# EAGLE design lcTempLogger (EAGLE 7.5.0)
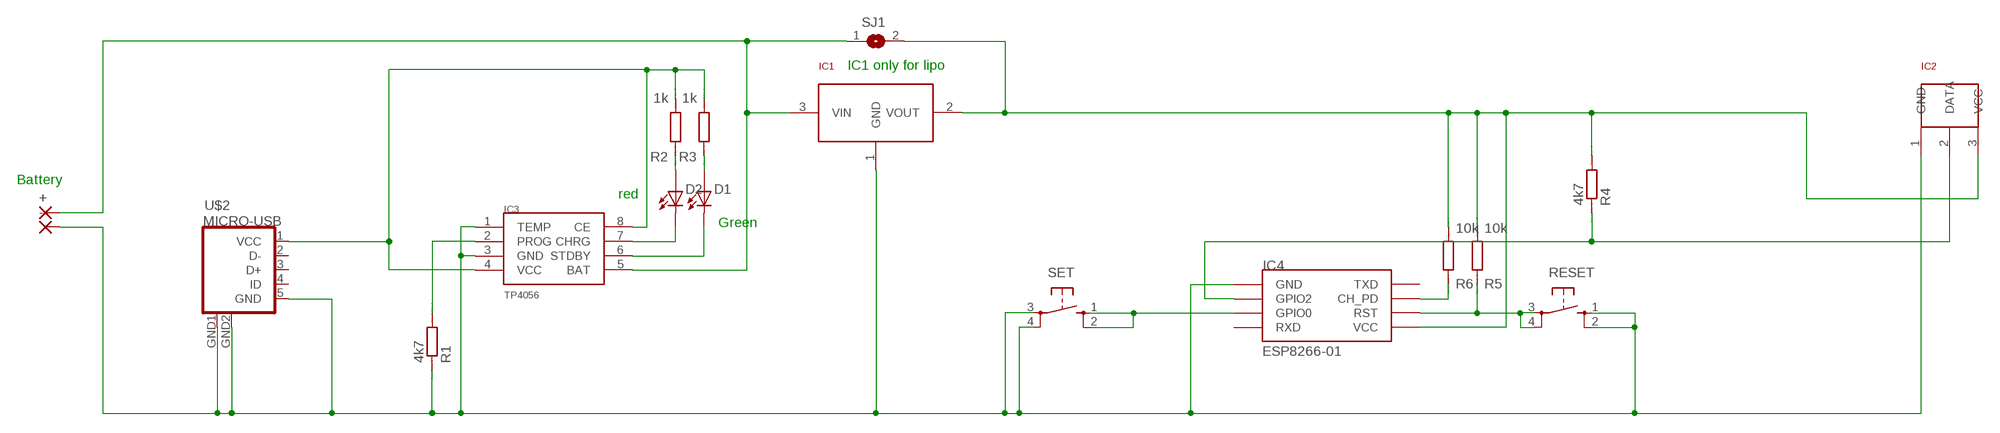
[diagram p0: schematic, sheet 1]

## Parts
+  1,6/0,8  [1,6/0,8]
-  1,6/0,8  [1,6/0,8]
D1  LED-0805  [CHIPLED_0805]
D2  LED-0805  [CHIPLED_0805]
IC1  MCP1700  MCP1700SOT-32  [SOT-23]
IC2  DS18B20TO-92  [TO-92]
IC3  TP4056  [SOP-8]
IC4  ESP8266-01  [ESP01]
R1  4k7  RR1206  [R1206]
R2  1k  R  [R0805]
R3  1k  R  [R0805]
R4  4k7  RR1206  [R1206]
R5  10k  RR1206  [R1206]
R6  10k  RR1206  [R1206]
RESET  10-XX  [B3F-10XX]
SET  10-XX  [B3F-10XX]
SJ1  SJ  [SJ]
U$2  MICRO-USB  [MICRO-USB]

## Nets
3V: IC1.2(VOUT) IC2.3(VCC) IC4.VCC R4.2 R5.2 R6.2 SJ1.2
5V_USB: IC3.4(VCC) IC3.8(CE) R2.2 R3.2 U$2.1(VCC)
GND: -.1(P) IC1.1(GND) IC2.1(GND) IC3.1(TEMP) IC3.3(GND) IC4.GND R1.1 RESET.1 RESET.2 SET.3 SET.4 U$2.5(GND) U$2.GND1(GND) U$2.GND2(GND)
N$2: D2.C(K) IC3.7(CHRG)
N$3: IC2.2(DATA) IC4.GPIO2 R4.1
N$4: +.1(P) IC1.3(VIN) IC3.5(BAT) SJ1.1
N$5: IC4.GPIO0 SET.1 SET.2
N$7: D1.C(K) IC3.6(STDBY)
N$8: IC3.2(PROG) R1.2
N$9: D2.A R2.1
N$10: D1.A R3.1
N$11: IC4.RST R5.1 RESET.3 RESET.4
N$12: IC4.CH_PD R6.1
Unconnected: IC4.RX(RXD) IC4.TX(TXD) U$2.2(D-) U$2.3(D+) U$2.4(ID)

## Notes on the sheet
- IC1 only for lipo
- Battery
- red
- Green

## Library data of the parts
+ - = wirepad:1,6/0,8: THROUGH-HOLE PAD
D1 D2 = Basic:LED: LED
IC1 = templogger:MCP1700: MCP1700 Low Quiescent Current LDO
IC2 = templogger:DS18B20: Programmable Resolution Digital Thermometer This chip provides a onewire thermosensor with approx. 0.5°C accuracy. A programmable over/undertemperure alarm is available. The precision can be set from 9..12 bits. Notes: Vdd must be applied for accurate measurements at low temperatures, as the parasite power circuit otherwise heats the sensor. If parasite power is used, Vdd has to be connected to GND. The DS1822 is a low-cost thermometer chip, the DS18S20 is similar to the DS18B20, but with 9 Bit precision only. Author: Jan Kandziora <jjj@gmx.de>
IC3 = templogger:TP4056
IC4 = templogger:ESP8266-01: ESP8266 Wifi module 01
R1-R6 = eagle-ltspice:R: RESISTOR, European symbol; SPICEMODEL: NONE; SPICEPREFIX: R
RESET SET = Basic:10-XX: OMRON SWITCH
SJ1 = jumper:SJ: SMD solder JUMPER
U$2 = templogger:MICRO-USB: Micro USB B connector

## Board
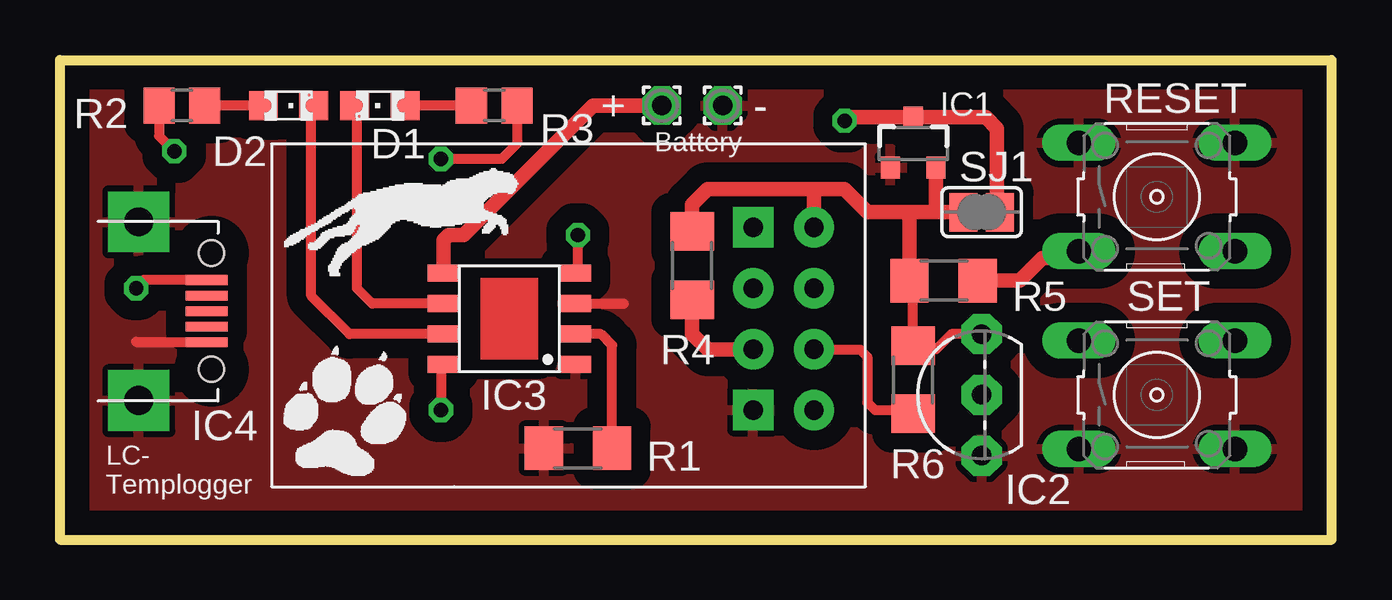
[diagram p1: board, top side]
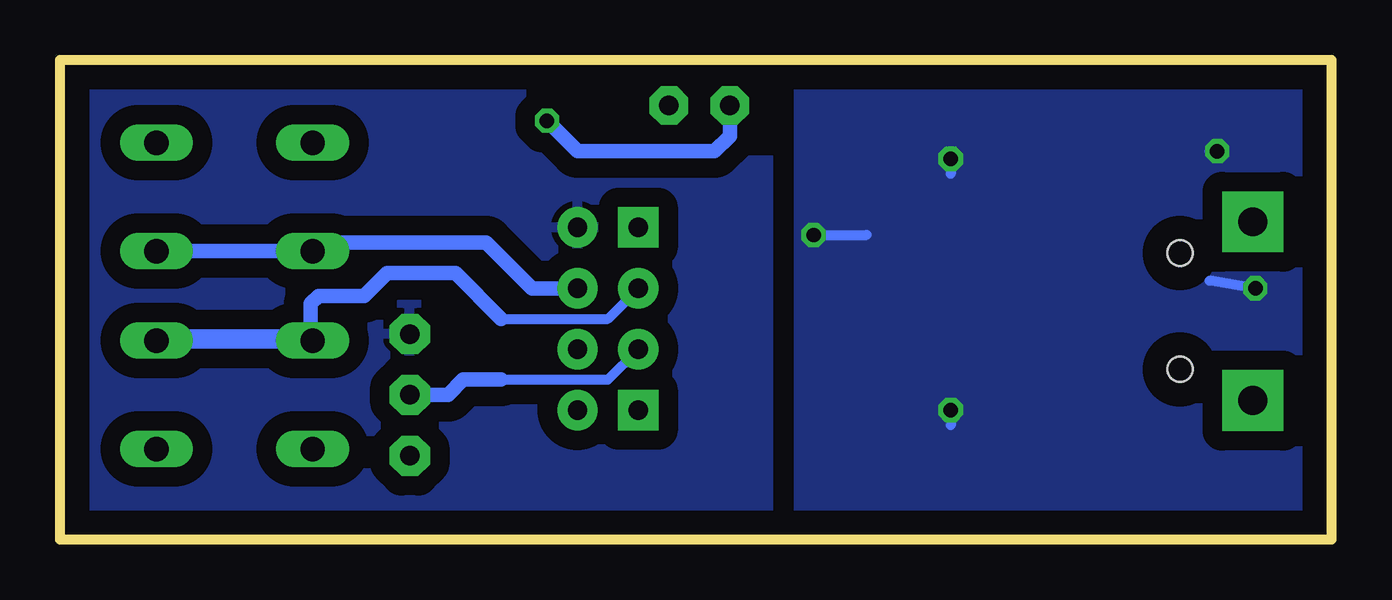
[diagram p2: board, bottom side, seen from below]

Size 53 x 20 mm. Coordinates in mm from the lower left corner, seen from the top.
Outline: 0,0 0,20 53,20 53,0 0,0
Copper layers (1*16): Top 0.035mm / dielectric 1.5mm / Bottom 0.035mm
Design rules "default": minimum track width 10mil, minimum drill 24mil, track to track 8mil, track to pad 8mil, pad to pad 8mil, via to via 8mil, smd to smd 8mil, copper to edge 40mil, drill to drill 8mil, minimum pad ring 10mil, minimum via ring 8mil, stop-mask expansion 4mil, vias tented up to drill 0mil, thermal gap 10mil
bRestrict: area 36.2,7.3 to 37.1,9.5; area 23.5,16.8 to 24.1,18.7

### Footprints (pad centres in the part's own frame; a part is rotated, then mirrored left to right if it is on the bottom)
1,6/0,8 = drill 0.813 pad 1.6 octagon: 1 0,0
CHIPLED_0805 = smd 1.2 x 1.2: A 0,-1.05; C 0,1.05
SOT-23 = smd 0.8 x 0.9: 1 -0.95,-1; 2 0.95,-1; 3 0,1.1
TO-92 = drill 0.813 pad 1.676 octagon: 1 -2.54,0; 2 0,0; 3 2.54,0
SOP-8 = smd 1.3 x 0.7: 1 -2.75,1.905; 2 -2.75,0.635; 3 -2.75,-0.635; 4 -2.75,-1.905; 5 2.75,-1.905; 6 2.75,-0.635; 7 2.75,0.635; 8 2.75,1.905
ESP01 = drill 0.8 pad 1.676: CH_PD -1.27,-7.62; GPIO0 1.27,-5.08; GPIO2 -1.27,-5.08; RST 1.27,-7.62; TX -3.81,-7.62; VCC 3.81,-7.62 | drill 0.8 pad 1.676 square: GND -3.81,-5.08; RX 3.81,-5.08
R1206 = smd 1.6 x 1.803: 1 -1.422,0; 2 1.422,0
R0805 = smd 1.3 x 1.5: 1 -0.95,0; 2 0.95,0
B3F-10XX = drill 1.016 pad 1.524 long: 1 -3.251,2.261; 2 3.251,2.261; 3 -3.251,-2.261; 4 3.251,-2.261
SJ = smd 1.168 x 1.6: 1 -0.762,0; 2 0.762,0
MICRO-USB = smd 0.4 x 1.75: 1 -1.3,4.525; 2 -0.65,4.525; 3 0,4.525; 4 0.65,4.525; 5 1.3,4.525 | drill 1.2 pad 2.54 square: GND1 -3.725,1.7; GND2 3.725,1.7 | hole 1.05: -2.425,4.73; 2.425,4.73

### Placement (x,y rotation side)
+  25.08,18.1 0 top
-  27.62,18.1 0 top
D1  13.34,18.1 90 top
D2  9.53,18.1 270 top
IC1  35.56,16.51 0 top
IC2  38.42,6.03 90 top
IC3  18.73,9.21 180 top
IC4  23.81,9.21 90 top
R1  21.59,3.81 0 top
R2  5.08,18.1 180 top
R3  18.1,18.1 0 top
R4  26.35,11.43 90 top
R5  36.83,10.79 180 top
R6  35.56,6.67 90 top
RESET  45.72,14.29 0 top
SET  45.72,6.03 0 top
SJ1  38.42,13.65 180 top
U$1  [LOGO-21-SMALL-PAW]  11.75,5.08 0 top
U$2  1.59,9.53 270 top
U$3  [LOGO-21-MIDDLE-CHEETAH]  14.29,13.97 0 top

### Tracks (layer width: path | path; a pad name or v marks a point on that pad's centre or on a via)
3V
  Top 0.406: R6.2 35.56,10.64 R5.2 | IC2.3 37.15,8.57 36.51,7.94 35.56,7.94
  Top 0.61: 35.24,13.65 33.66,13.65 32.7,14.61 31.43,14.61 | 35.24,13.65 36.51,13.65 | 36.51,13.65 SJ1.2 | IC1.2 36.51,13.65 | R5.2 35.41,13.49 35.24,13.65 | R4.2 26.35,13.97 26.99,14.61 31.43,14.61 | 31.43,14.61 IC4.VCC
  pour Bottom (isolate 0.813): 23.5,19.37 23.5,0.64 52.39,0.64 52.39,19.37
5V_USB  (via drill 0.6 pad 0.81)
  Top 0.406: U$2.1 3.49,10.82 v3.17,10.48 | IC3.4 21.59,11.11 v21.59,12.7 | IC3.8 15.88,7.3 v15.88,5.4 | R3.2 19.05,16.51 18.41,15.88 v15.88,15.88 | R2.2 4.13,16.82 v4.76,16.19
  Bottom 0.406: v3.17,10.48 5.08,10.79 | v21.59,12.7 19.37,12.7 | v15.88,5.4 15.88,4.76 | v15.88,15.88 15.88,15.24 | v4.76,16.19 5.08,16.19
  pour Bottom (isolate 0.813): 0.64,19.68 22.23,19.68 22.23,0.64 0.64,0.64
GND
  Top 0.406: IC3.3 23.5,9.84 | U$2.5 3.21,8.22 3.17,8.26
  pour Top (isolate 0.813): 0.64,19.37 52.39,19.37 52.39,0.64 0.64,0.64
N$2
  Top 0.406: IC3.7 12.06,8.57 10.48,10.16 10.48,18 D2.C
N$3
  Top 0.61: IC4.GPIO2 27,7.92 26.35,8.57 R4.1
  Bottom 0.406: 34.61,6.67 30.16,6.67 IC4.GPIO2
  Bottom 0.61: IC2.2 36.83,6.03 36.2,6.67 34.61,6.67
N$4  (via drill 0.6 pad 0.81)
  Top 0.406: 35.73,17.78 IC1.3
  Top 0.61: IC3.5 15.98,12.49 16.19,12.7 16.83,12.7 22.23,18.1 +.1 | SJ1.1 39.05,13.78 39.05,17.14 38.59,17.61 IC1.3 32.85,17.61 v32.7,17.46
  Bottom 0.61: v32.7,17.46 31.43,16.19 25.72,16.19 25.08,16.83 +.1
N$5
  Bottom 0.406: 34.61,9.21 30.16,9.21 IC4.GPIO0
  Bottom 0.61: 34.61,9.21 36.51,11.11 39.37,11.11 40.32,10.16 42.23,10.16 42.55,9.84 42.55,8.37 SET.1
  Bottom 0.813: 42.55,8.37 48.9,8.37 SET.2
N$7
  Top 0.406: IC3.6 13.02,9.84 12.38,10.48 12.38,18 D1.C
N$8
  Top 0.406: R1.2 23.01,8.1 22.54,8.57 IC3.2
N$9
  Top 0.406: D2.A R2.1
N$10
  Top 0.406: R3.1 D1.A
N$11
  Top 0.61: R5.1 40.01,10.79 40.96,11.75 42.19,11.75 RESET.3
  Bottom 0.61: RESET.4 RESET.3 42.11,12.38 35.24,12.38 33.32,10.46 IC4.RST
N$12
  Top 0.406: IC4.CH_PD 33.35,7.92 33.66,7.62 33.66,5.71 33.97,5.4 35.41,5.4 R6.1

### Text on the board
tNames: Battery | LC- / Templogger